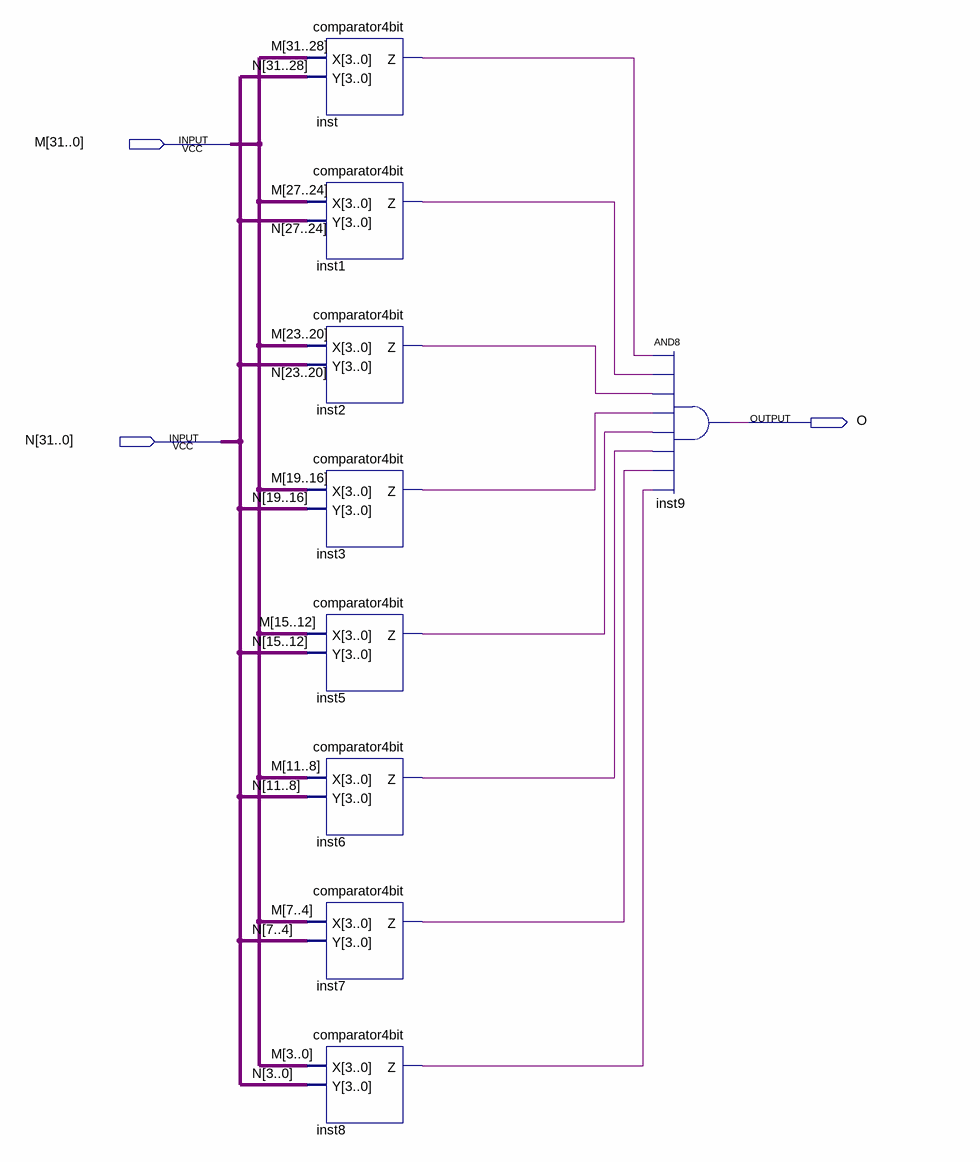
[diagram p0: schematic sheet]
// Quartus schematic comparator8bit.bdf as structural Verilog: 9 symbols, 3 pins
module comparator8bit (
  input  [31:0] M,
  input  [31:0] N,
  output O
);

  wire inst1_z, inst2_z, inst3_z, inst5_z, inst6_z, inst7_z, inst8_z, inst_z;

  comparator4bit inst (.X(M[31:28]), .Y(N[31:28]), .Z(inst_z));
  comparator4bit inst1 (.X(M[27:24]), .Y(N[27:24]), .Z(inst1_z));
  comparator4bit inst2 (.X(M[23:20]), .Y(N[23:20]), .Z(inst2_z));
  comparator4bit inst3 (.X(M[19:16]), .Y(N[19:16]), .Z(inst3_z));
  comparator4bit inst5 (.X(M[15:12]), .Y(N[15:12]), .Z(inst5_z));
  comparator4bit inst6 (.X(M[11:8]), .Y(N[11:8]), .Z(inst6_z));
  comparator4bit inst7 (.X(M[7:4]), .Y(N[7:4]), .Z(inst7_z));
  comparator4bit inst8 (.X(M[3:0]), .Y(N[3:0]), .Z(inst8_z));
  and inst9 (O, inst_z, inst1_z, inst2_z, inst3_z, inst5_z, inst6_z, inst7_z, inst8_z);
endmodule
